# Altium schematic sheet Minty-sniffle.SchDoc
size 297 x 209 mm
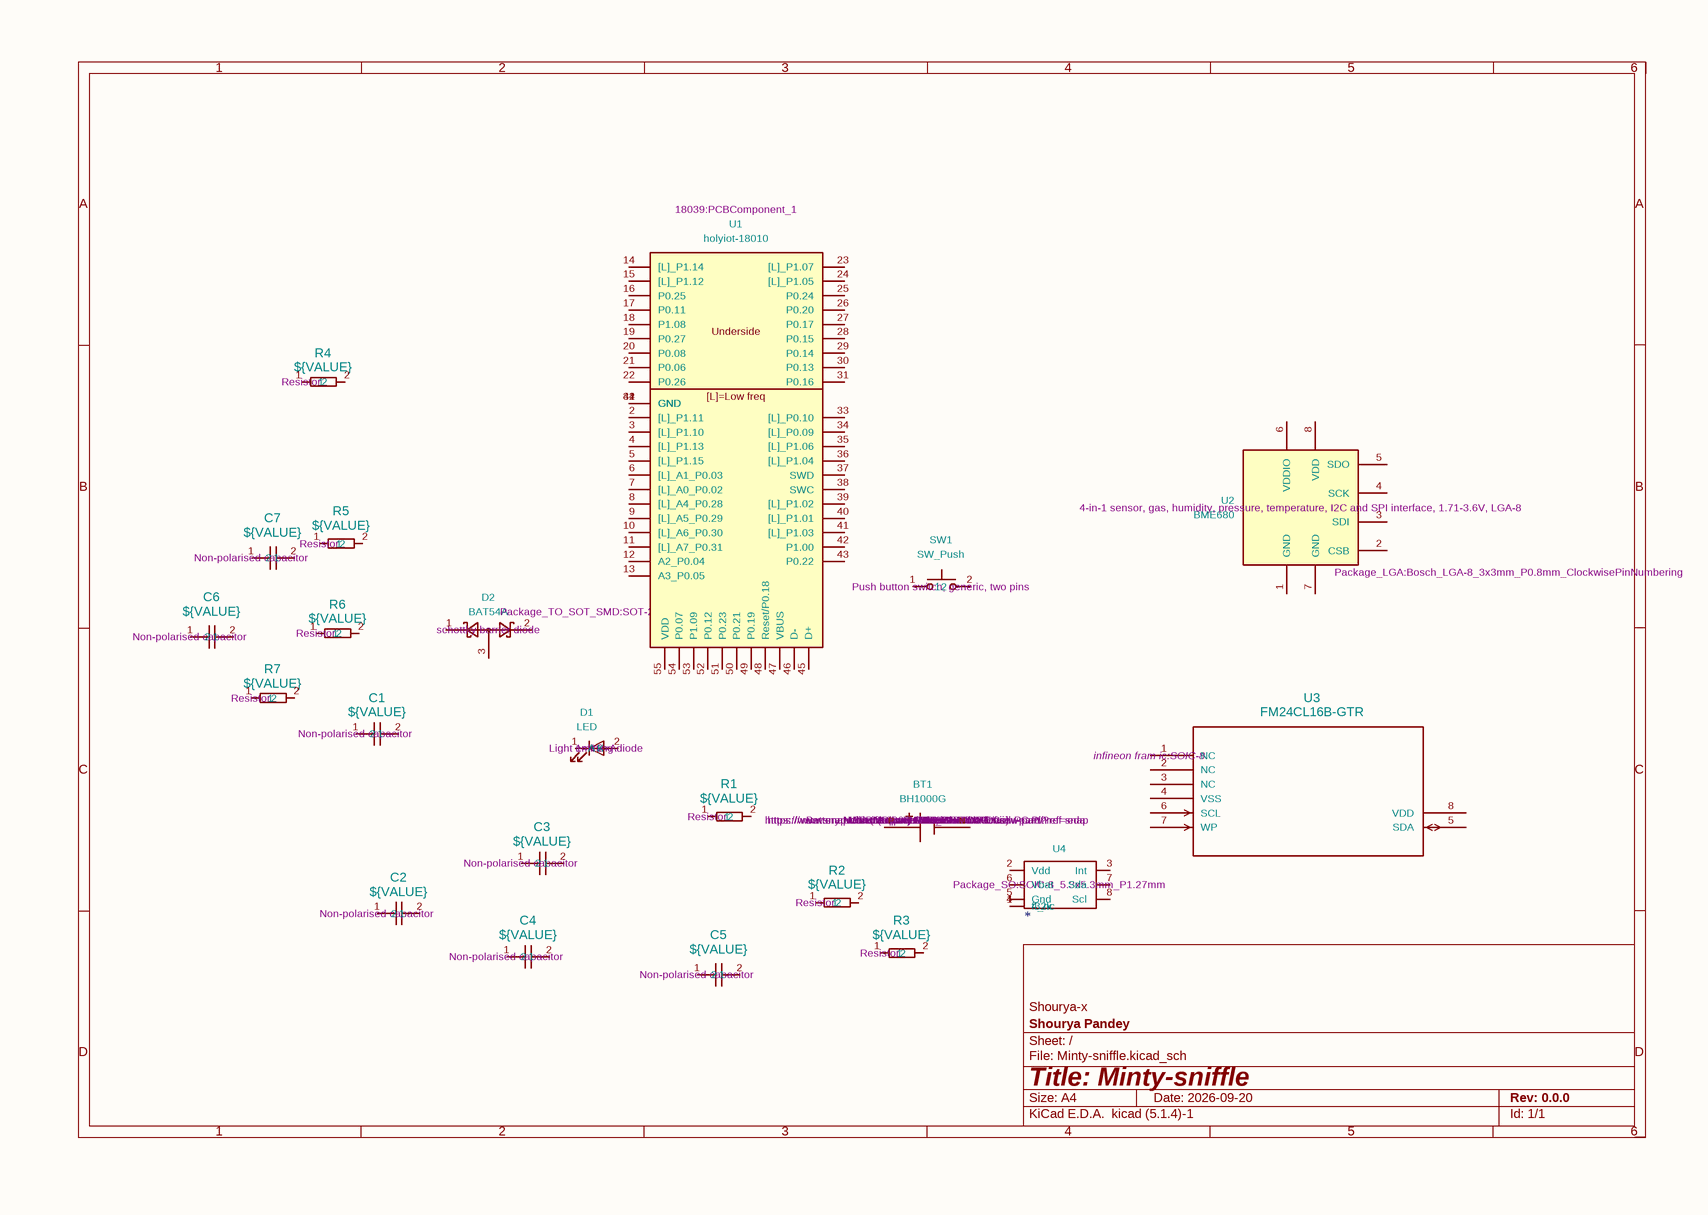
[diagram p0: Minty-sniffle.SchDoc]

## Parts
BT1  Description: Battery Holder (Open) Coin, 24.5mm 1 Cell PC Pin  MF: MPD (Memory Protection Devices)  MAXIMUM_PACKAGE_HEIGHT: 12.6mm  Package: None  STANDARD: Manufacturer Recommendations  PARTREV: E  Availability: In Stock  MANUFACTURER: MPD  Footprint: BH1000G:BAT_BH1000G  [BAT_BH1000G]  (hidden comment: BH1000G)
C1  Description: Non-polarised capacitor  (hidden comment: ${VALUE})
C2  Description: Non-polarised capacitor  (hidden comment: ${VALUE})
C3  Description: Non-polarised capacitor  (hidden comment: ${VALUE})
C4  Description: Non-polarised capacitor  (hidden comment: ${VALUE})
C5  Description: Non-polarised capacitor  (hidden comment: ${VALUE})
C6  Description: Non-polarised capacitor  (hidden comment: ${VALUE})
C7  Description: Non-polarised capacitor  (hidden comment: ${VALUE})
D1  Description: Light emitting diode  Sim.Pins: 1=K 2=A  (hidden comment: LED)
D2  Description: schottky barrier diode  Footprint: Package_TO_SOT_SMD:SOT-23  [SOT-23]  (hidden comment: BAT54A)
R1  ${VALUE}
R2  ${VALUE}
R3  ${VALUE}
R4  ${VALUE}
R5  ${VALUE}
R6  ${VALUE}
R7  ${VALUE}
SW1  Description: Push button switch, generic, two pins  (hidden comment: SW_Push)
U1  Footprint: 18039:PCBComponent_1  [PCBComponent_1]  (hidden comment: holyiot-18010)
U2  Description: 4-in-1 sensor, gas, humidity, pressure, temperature, I2C and SPI interface, 1.71-3.6V, LGA-8  Footprint: Package_LGA:Bosch_LGA-8_3x3mm_P0.8mm_ClockwisePinNumbering  [Bosch_LGA-8_3x3mm_P0.8mm_ClockwisePinNumbering]  (hidden comment: BME680)
U3  Footprint: infineon fram ic:SOIC-8  [SOIC-8]  (hidden comment: FM24CL16B-GTR)
U4  *  Footprint: Package_SO:SOIC-8_5.3x5.3mm_P1.27mm  [SOIC-8_5.3x5.3mm_P1.27mm]

## Nets
NetU1_1: U1.1(GND) U1.32(GND) U1.44(GND)
NetU4_1: U4.1(f32k) U4.4(4_nc)

Not connected (* = marked no-connect by the designer): BT1 N P; C1 1 2; C2 1 2; C3 1 2; C4 1 2; C5 1 2; C6 1 2; C7 1 2; D1 1(K) 2(A); D2 1 2 3; R1 1 2; R2 1 2; R3 1 2; R4 1 2; R5 1 2; R6 1 2; R7 1 2; SW1 1 2; U1 2([L]_P1.11) 3([L]_P1.10) 4([L]_P1.13) 5([L]_P1.15) 6([L]_A1_P0.03) 7([L]_A0_P0.02) 8([L]_A4_P0.28) 9([L]_A5_P0.29) 10([L]_A6_P0.30) 11([L]_A7_P0.31) 12(A2_P0.04) 13(A3_P0.05) 14([L]_P1.14) 15([L]_P1.12) 16(P0.25) 17(P0.11) 18(P1.08) 19(P0.27) 20(P0.08) 21(P0.06) 22(P0.26) 23([L]_P1.07) 24([L]_P1.05) 25(P0.24) 26(P0.20) 27(P0.17) 28(P0.15) 29(P0.14) 30(P0.13) 31(P0.16) 33([L]_P0.10) 34([L]_P0.09) 35([L]_P1.06) 36([L]_P1.04) 37(SWD) 38(SWC) 39([L]_P1.02) 40([L]_P1.01) 41([L]_P1.03) 42(P1.00) 43(P0.22) 45(D+) 46(D-) 47(VBUS) 48(Reset/P0.18) 49(P0.19) 50(P0.21) 51(P0.23) 52(P0.12) 53(P1.09) 54(P0.07) 55(VDD); U2 1(GND) 2(CSB) 3(SDI) 4(SCK) 5(SDO) 6(VDDIO) 7(GND) 8(VDD); U3 1(NC) 2(NC) 3(NC) 4(VSS) 5(SDA) 6(SCL) 7(WP) 8(VDD); U4 2(Vdd) 3(Int) 5(Gnd) 6(Vbat) 7(Sda) 8(Scl)

## Notes on the sheet
- 1
- 2
- 3
- 4
- 5
- 6
- A
- B
- C
- Shourya-x
- D
- Title: Minty-sniffle
- File: Minty-sniffle.kicad_sch
- Sheet: /
- Shourya Pandey
- KiCad E.D.A.  kicad (5.1.4)-1
- Size: A4
- Date: 2026-09-20
- Rev: 0.0.0
- Id: 1/1
- (in symbol holyiot-18010) Underside; [L]=Low freq

## Library data of the parts
C1-C7 = Capacitor - non polarized: Value: ${VALUE}
R1-R7 = Resistor: Description: Resistor; Value: ${VALUE}
U4 = SD3031
BT1 = BH1000G: Price: None; Check_prices: https://www.snapeda.com/parts/BH1000G/MPD/view-part/?ref=eda; SnapEDA_Link: https://www.snapeda.com/parts/BH1000G/MPD/view-part/?ref=snap; MP: BH1000G; Value: BH1000G
D1 = LED: Value: LED
D2 = BAT54A: Value: BAT54A
SW1 = SW_Push: Value: SW_Push
U1 = holyiot-18010: Value: holyiot-18010
U2 = BME680: Value: BME680
U3 = FM24CL16B-GTR: Value: FM24CL16B-GTR